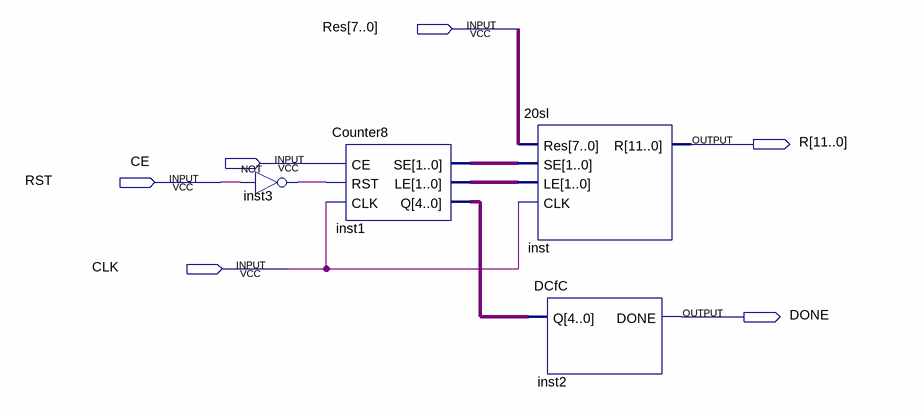
[diagram p0: schematic sheet]
// Quartus schematic DatapathDD.bdf as structural Verilog: 4 symbols, 6 pins
module DatapathDD (
  input  [7:0] Res,
  input  CE,
  input  RST,
  input  CLK,
  output [11:0] R,
  output DONE
);

  wire inst3_out;
  wire [1:0] inst1_le, inst1_se;
  wire [4:0] inst1_q;

  not inst3 (inst3_out, RST);
  Counter8 inst1 (.CE(CE), .RST(inst3_out), .CLK(CLK), .SE(inst1_se), .LE(inst1_le), .Q(inst1_q));
  \20sl  inst (.Res(Res), .SE(inst1_se), .LE(inst1_le), .CLK(CLK), .R(R));
  DCfC inst2 (.Q(inst1_q), .DONE(DONE));
endmodule
